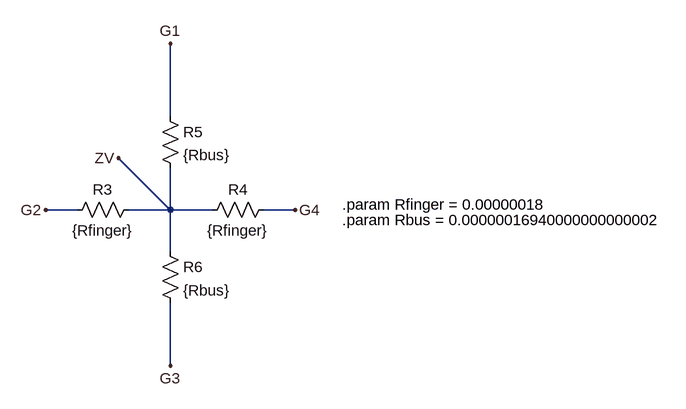
[diagram p0: schematic IVBottomElementISO.asc]
IVBottomElementISO.asc, the LTspice schematic file:
Version 4
SHEET 1 880 680
WIRE 48 48 48 -64
WIRE -96 192 -144 192
WIRE 48 192 -32 112
WIRE 48 192 48 128
WIRE 48 192 -16 192
WIRE 112 192 48 192
WIRE 240 192 192 192
WIRE 48 256 48 192
WIRE 48 432 48 336
FLAG 48 -64 G1
FLAG 48 432 G3
FLAG -144 192 G2
FLAG 240 192 G4
FLAG -32 112 ZV
SYMBOL res 0 176 R90
WINDOW 0 0 56 VBottom 2
WINDOW 3 32 56 VTop 2
SYMATTR InstName R3
SYMATTR Value {Rfinger}
SYMBOL res 208 176 R90
WINDOW 0 0 56 VBottom 2
WINDOW 3 32 56 VTop 2
SYMATTR InstName R4
SYMATTR Value {Rfinger}
SYMBOL res 32 32 R0
SYMATTR InstName R5
SYMATTR Value {Rbus}
SYMBOL res 32 240 R0
SYMATTR InstName R6
SYMATTR Value {Rbus}
TEXT 312 184 Left 2 !.param Rfinger = 0.00000018
TEXT 312 208 Left 2 !.param Rbus = 0.00000016940000000000002

The netlist it stands for:
* IVBottomElementISO.asc
R3 ZV G2 {Rfinger}
R4 G4 ZV {Rfinger}
R5 G1 ZV {Rbus}
R6 ZV G3 {Rbus}
.param Rfinger = 0.00000018
.param Rbus = 0.00000016940000000000002
.backanno
.end